# EAGLE schematic calculator2 (EAGLE 9.6.2)
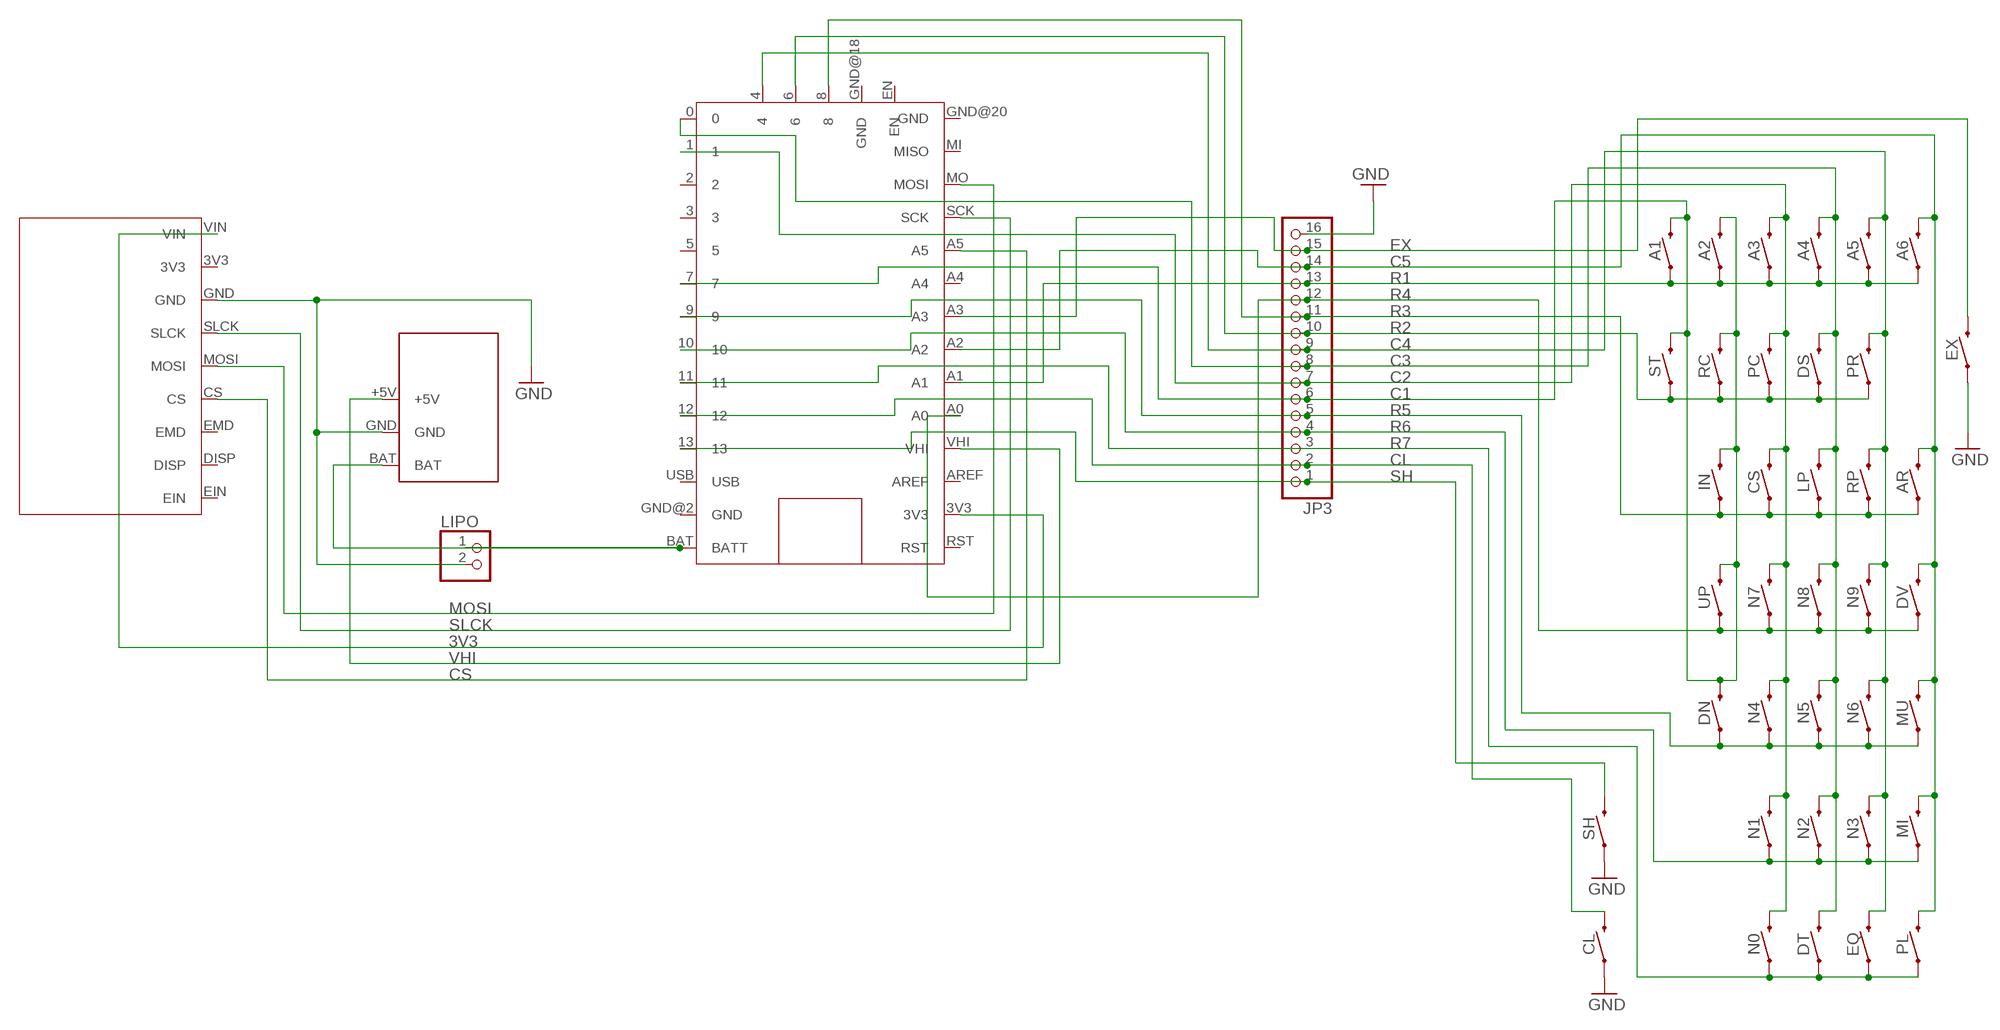
[diagram p0: schematic, sheet 1]

## Parts
A1  MOMENTARY-SWITCH-SPST-PTH-6.0MM  [TACTILE_SWITCH_PTH_6.0MM]
A2  MOMENTARY-SWITCH-SPST-PTH-6.0MM  [TACTILE_SWITCH_PTH_6.0MM]
A3  MOMENTARY-SWITCH-SPST-PTH-6.0MM  [TACTILE_SWITCH_PTH_6.0MM]
A4  MOMENTARY-SWITCH-SPST-PTH-6.0MM  [TACTILE_SWITCH_PTH_6.0MM]
A5  MOMENTARY-SWITCH-SPST-PTH-6.0MM  [TACTILE_SWITCH_PTH_6.0MM]
A6  MOMENTARY-SWITCH-SPST-PTH-6.0MM  [TACTILE_SWITCH_PTH_6.0MM]
AR  MOMENTARY-SWITCH-SPST-PTH-6.0MM  [TACTILE_SWITCH_PTH_6.0MM]
CHARGER  PROTRINKET  [PROTRINKET]
CL  MOMENTARY-SWITCH-SPST-PTH-6.0MM  [TACTILE_SWITCH_PTH_6.0MM]
CONTROLLER  IB32U4  [IB32U4]
CS  MOMENTARY-SWITCH-SPST-PTH-6.0MM  [TACTILE_SWITCH_PTH_6.0MM]
DN  MOMENTARY-SWITCH-SPST-PTH-6.0MM  [TACTILE_SWITCH_PTH_6.0MM]
DS  MOMENTARY-SWITCH-SPST-PTH-6.0MM  [TACTILE_SWITCH_PTH_6.0MM]
DT  MOMENTARY-SWITCH-SPST-PTH-6.0MM  [TACTILE_SWITCH_PTH_6.0MM]
DV  MOMENTARY-SWITCH-SPST-PTH-6.0MM  [TACTILE_SWITCH_PTH_6.0MM]
EQ  MOMENTARY-SWITCH-SPST-PTH-6.0MM  [TACTILE_SWITCH_PTH_6.0MM]
EX  MOMENTARY-SWITCH-SPST-PTH-6.0MM  [TACTILE_SWITCH_PTH_6.0MM]
IN  MOMENTARY-SWITCH-SPST-PTH-6.0MM  [TACTILE_SWITCH_PTH_6.0MM]
JP3  PINHD-1X16  [1X16]
LIPO  PINHD-1X2  [1X02]
LP  MOMENTARY-SWITCH-SPST-PTH-6.0MM  [TACTILE_SWITCH_PTH_6.0MM]
MI  MOMENTARY-SWITCH-SPST-PTH-6.0MM  [TACTILE_SWITCH_PTH_6.0MM]
MU  MOMENTARY-SWITCH-SPST-PTH-6.0MM  [TACTILE_SWITCH_PTH_6.0MM]
N0  MOMENTARY-SWITCH-SPST-PTH-6.0MM  [TACTILE_SWITCH_PTH_6.0MM]
N1  MOMENTARY-SWITCH-SPST-PTH-6.0MM  [TACTILE_SWITCH_PTH_6.0MM]
N2  MOMENTARY-SWITCH-SPST-PTH-6.0MM  [TACTILE_SWITCH_PTH_6.0MM]
N3  MOMENTARY-SWITCH-SPST-PTH-6.0MM  [TACTILE_SWITCH_PTH_6.0MM]
N4  MOMENTARY-SWITCH-SPST-PTH-6.0MM  [TACTILE_SWITCH_PTH_6.0MM]
N5  MOMENTARY-SWITCH-SPST-PTH-6.0MM  [TACTILE_SWITCH_PTH_6.0MM]
N6  MOMENTARY-SWITCH-SPST-PTH-6.0MM  [TACTILE_SWITCH_PTH_6.0MM]
N7  MOMENTARY-SWITCH-SPST-PTH-6.0MM  [TACTILE_SWITCH_PTH_6.0MM]
N8  MOMENTARY-SWITCH-SPST-PTH-6.0MM  [TACTILE_SWITCH_PTH_6.0MM]
N9  MOMENTARY-SWITCH-SPST-PTH-6.0MM  [TACTILE_SWITCH_PTH_6.0MM]
PC  MOMENTARY-SWITCH-SPST-PTH-6.0MM  [TACTILE_SWITCH_PTH_6.0MM]
PL  MOMENTARY-SWITCH-SPST-PTH-6.0MM  [TACTILE_SWITCH_PTH_6.0MM]
PR  MOMENTARY-SWITCH-SPST-PTH-6.0MM  [TACTILE_SWITCH_PTH_6.0MM]
RC  MOMENTARY-SWITCH-SPST-PTH-6.0MM  [TACTILE_SWITCH_PTH_6.0MM]
RP  MOMENTARY-SWITCH-SPST-PTH-6.0MM  [TACTILE_SWITCH_PTH_6.0MM]
SH  MOMENTARY-SWITCH-SPST-PTH-6.0MM  [TACTILE_SWITCH_PTH_6.0MM]
SHARPMEM  SHARPMEM  [SHARPMEM]
ST  MOMENTARY-SWITCH-SPST-PTH-6.0MM  [TACTILE_SWITCH_PTH_6.0MM]
UP  MOMENTARY-SWITCH-SPST-PTH-6.0MM  [TACTILE_SWITCH_PTH_6.0MM]

## Nets
3V3: CONTROLLER.3V3 SHARPMEM.VIN
C1: A1.3 A2.3 CONTROLLER.7 DN.3 IN.3 JP3.6 RC.3 ST.3 UP.3
C2: A3.3 CONTROLLER.1 CS.3 JP3.7 N0.3 N1.3 N4.3 N7.3 PC.3
C3: A4.3 CONTROLLER.0 DS.3 DT.3 JP3.8 LP.3 N2.3 N5.3 N8.3
C4: A5.3 CONTROLLER.4 EQ.3 JP3.9 N3.3 N6.3 N9.3 PR.3 RP.3
C5: A6.3 AR.3 CONTROLLER.A2 DV.3 JP3.14 MI.3 MU.3 PL.3
CL: CL.3 CONTROLLER.12 JP3.2
CS: CONTROLLER.A5 SHARPMEM.CS
EX: CONTROLLER.A3 EX.3 JP3.15
GND: CHARGER.GND CL.1 EX.1 JP3.16 LIPO.2 SH.1 SHARPMEM.GND
MOSI: CONTROLLER.MO(MOSI) SHARPMEM.MOSI
N$1: CHARGER.BAT CONTROLLER.BAT(BATT) LIPO.1
R1: A1.1 A2.1 A3.1 A4.1 A5.1 A6.1 CONTROLLER.A1 JP3.13
R2: CONTROLLER.6 DS.1 JP3.10 PC.1 PR.1 RC.1 ST.1
R3: AR.1 CONTROLLER.8 CS.1 IN.1 JP3.11 LP.1 RP.1
R4: CONTROLLER.A0 DV.1 JP3.12 N7.1 N8.1 N9.1 UP.1
R5: CONTROLLER.9 DN.1 JP3.5 MU.1 N4.1 N5.1 N6.1
R6: CONTROLLER.10 JP3.4 MI.1 N1.1 N2.1 N3.1
R7: CONTROLLER.11 DT.1 EQ.1 JP3.3 N0.1 PL.1
SH: CONTROLLER.13 JP3.1 SH.3
SLCK: CONTROLLER.SCK SHARPMEM.SLCK
VHI: CHARGER.+5V CONTROLLER.VHI
Unconnected: CONTROLLER.2 CONTROLLER.3 CONTROLLER.5 CONTROLLER.A4 CONTROLLER.AREF CONTROLLER.EN CONTROLLER.GND@2(GND) CONTROLLER.GND@18(GND) CONTROLLER.GND@20(GND) CONTROLLER.MI(MISO) CONTROLLER.RST CONTROLLER.USB SHARPMEM.3V3 SHARPMEM.DISP SHARPMEM.EIN SHARPMEM.EMD

## Library data of the parts
A1-A6 AR CL CS DN DS DT DV EQ EX IN LP MI MU N0 N1-N9 PC PL PR RC RP SH ST UP = SparkFun-Switches:MOMENTARY-SWITCH-SPST: Momentary Switch (Pushbutton) - SPST Normally-open (NO) SPST momentary switches (buttons, pushbuttons). Variants PTH-12MM - 12mm square, through-hole Momentary Pushbutton Switch - 12mm Square <https://www.sparkfun.com/products/9190> (COM-09190) PTH-6.0MM, PTH-6.0MM-KIT - 6.0mm square, through-hole Mini Pushbutton Switch <https://www.sparkfun.com/products/97> (COM-00097) KIT package intended for soldering kit's - only one side of pads' copper is exposed. PTH-RIGHT-ANGLE-KIT - Right-angle, through-hole Right Angle Tactile Button <https://www.sparkfun.com/products/10791> - Used on SparkFun BigTime Watch Kit <https://www.sparkfun.com/products/11734> SMD-12MM - 12mm square, surface-mount Tactile Button - SMD (12mm) <https://www.sparkfun.com/products/12993> (COM-12993) Used on SparkFun PicoBoard <https://www.sparkfun.com/products/11888> SMD-4.5MM - 4.5mm Square Trackball Switch Used on SparkFun Blackberry Trackballer Breakout <https://www.sparkfun.com/products/13169> SMD-4.6MMX2.8MM - 4.60mm x 2.80mm, surface mount Used on SparkFun SAMD21 Mini Breakout <https://www.sparkfun.com/products/13664> SMD-5.2MM, SMD-5.2-REDUNDANT - 5.2mm square, surface-mount Mini Pushbutton Switch - SMD <https://www.sparkfun.com/products/8720> (COM-08720) Used on Arduino Pro Mini <https://www.sparkfun.com/products/11114> REDUNDANT package connects both switch circuits together SMD-6.0X3.5MM - 6.0 x 3.5mm, surface mount Momentary Reset Switch SMD <https://www.sparkfun.com/products/8229> (COM-08229) SMD-6.2MM-TALL - 6.2mm square, surface mount Tactile Button - SMD (6mm) <https://www.sparkfun.com/products/12992> Used on SparkFun Digital Sandbox <https://www.sparkfun.com/products/12651> SMD-RIGHT-ANGLE - Right-angle, surface mount Used on SparkFun Block for Intel® Edison - Arduino <https://www.sparkfun.com/products/13036>; PROD_ID: SWCH-08441; SF_SKU: COM-00097
CHARGER = pwlib:PROTRINKET
CONTROLLER = pwlib:IB32U4
JP3 = pinhead:PINHD-1X16: PIN HEADER
LIPO = pinhead:PINHD-1X2: PIN HEADER
SHARPMEM = pwlib:SHARPMEM